# EAGLE design Active Electrode (EAGLE 7.6.0)
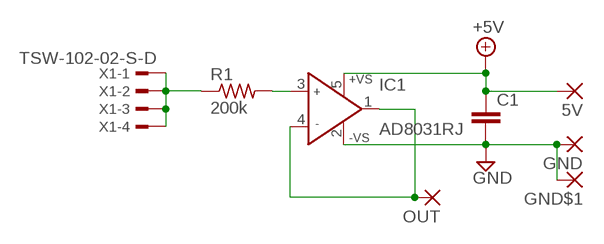
[diagram p0: schematic, sheet 1]

## Parts
5V  1,6/0,9  [1,6/0,9]
C1  C-EUC1206  [C1206]
GND  1,6/0,9  [1,6/0,9]
GND$1  1,6/0,9  [1,6/0,9]
IC1  AD8031RJ  [SOT23-5]
OUT  1,6/0,9  [1,6/0,9]
R1  200k  R-US_M1206  [M1206]
X1  TSW-102-02-S-D  [TSW-102-02-S-D]

## Nets
+5V: 5V.1(P) C1.1 IC1.5(+VS)
GND: C1.2 GND$1.1(P) GND.1(P) IC1.2(-VS)
N$1: R1.1 X1.1 X1.2 X1.3 X1.4
N$2: IC1.3(IN+) R1.2
N$3: IC1.1(OUT) IC1.4(IN-) OUT.1(P)

## Library data of the parts
5V GND GND$1 OUT = wirepad:1,6/0,9: THROUGH-HOLE PAD
C1 = resistor:C-EU: CAPACITOR, European symbol
IC1 = analog-devices:AD8031: 2.7 V, 800 ?A, 80 MHz Rail-to-Rail I/O Amplifiers Source: http://www.analog.com/static/imported-files/data_sheets/AD8031_8032.pdf; MPN: AD8031ARTZ-REEL7; OC_FARNELL: 1660972; OC_NEWARK: 84R8399
R1 = resistor:R-US_: RESISTOR, American symbol
X1 = con-samtec:TSW-102-02-S-D: THROUGH-HOLE .025" SQ POST HEADER Source: Samtec TSW.pdf; OC_FARNELL: unknown; OC_NEWARK: unknown

## Board
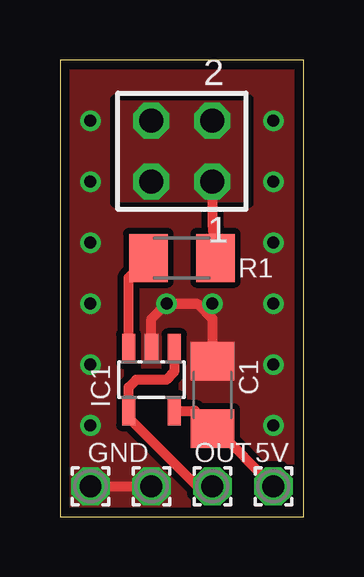
[diagram p1: board, top side]
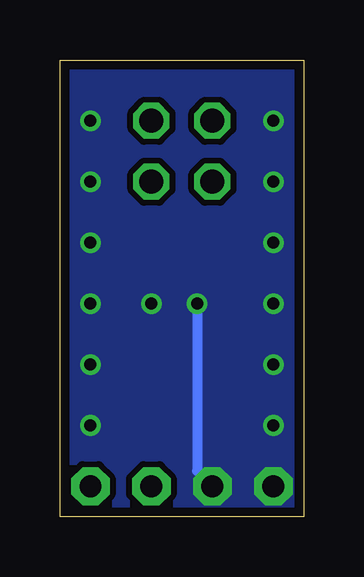
[diagram p2: board, bottom side, seen from below]

Size 10.16 x 19.05 mm. Coordinates in mm from the lower left corner, seen from the top.
Outline: 0,0 10.16,0 10.16,19.05 0,19.05 0,0
Copper layers (1*16): Top 0.0356mm / dielectric 1.5011mm / Bottom 0.0356mm
Design rules "Oshpark": minimum track width 6mil, minimum drill 13mil, track to track 6mil, track to pad 6mil, pad to pad 6mil, via to via 6mil, smd to smd 6mil, copper to edge 15mil, drill to drill 6mil, minimum pad ring 7mil, minimum via ring 7mil, stop-mask expansion 3mil, vias tented up to drill 0mil, thermal gap 10mil

### Footprints (pad centres in the part's own frame; a part is rotated, then mirrored left to right if it is on the bottom)
1,6/0,9 = drill 0.914 pad 1.6 octagon: 1 0,0
C1206 = smd 1.6 x 1.8: 1 -1.4,0; 2 1.4,0
SOT23-5 = smd 0.55 x 1.2: 1 -0.95,-1.3; 2 0,-1.3; 3 0.95,-1.3; 4 0.95,1.3; 5 -0.95,1.3
M1206 = smd 1.6 x 2: 1 -1.4,0; 2 1.4,0
TSW-102-02-S-D = drill 1 pad 1.5 octagon: 1 1.27,-1.27; 2 1.27,1.27; 3 -1.27,-1.27; 4 -1.27,1.27

### Placement (x,y rotation side)
5V  8.89,1.27 0 top
C1  6.35,5.08 90 top
GND  1.27,1.27 0 top
GND$1  3.81,1.27 0 top
IC1  3.81,5.71 180 top
OUT  6.35,1.27 0 top
R1  5.08,10.79 180 top
X1  5.08,15.24 0 top

### Tracks (layer width: path | path; a pad name or v marks a point on that pad's centre or on a via)
+5V
  Top 0.406: 5V.1 6.48,3.68 C1.1 5.62,4.42 IC1.5
GND  (via drill 0.5)
  Top 0.406: C1.2 6.35,8.26 5.71,8.89 v4.45,8.89 3.81,8.26 IC1.2 | GND.1 GND$1.1
  Bottom 0.406: v4.45,8.89 4.45,1.91 GND$1.1
  other vias: 1.27,16.51 1.27,13.97 1.27,11.43 1.27,8.89 1.27,3.81 1.27,6.35 8.89,3.81 8.89,6.35 6.35,8.89 8.89,8.89 8.89,11.43 8.89,16.51 8.89,13.97
  pour Top (isolate 0.254, rank 2, no thermals): 0,22.86 0,0 10.16,0 10.16,22.86
  pour Bottom (isolate 0.254, no thermals): 0,19.05 10.16,19.05 10.16,-3.81 0,-3.81
N$1
  Top 0.406: X1.1 6.35,12.2 R1.1
  pour Top (no thermals): 2.54,17.14 2.54,13.34 7.62,13.34 7.62,17.14
N$2
  Top 0.406: IC1.3 2.86,9.97 R1.2
N$3
  Top 0.406: IC1.1 4.76,6.03 4.45,5.71 3.17,5.71 2.86,5.4 IC1.4 2.86,4.12 5.71,1.27 OUT.1